# Altium schematic sheet 09_Zynq DDR.SchDoc
size A3; SheetNumber: 9; SheetTotal: 14
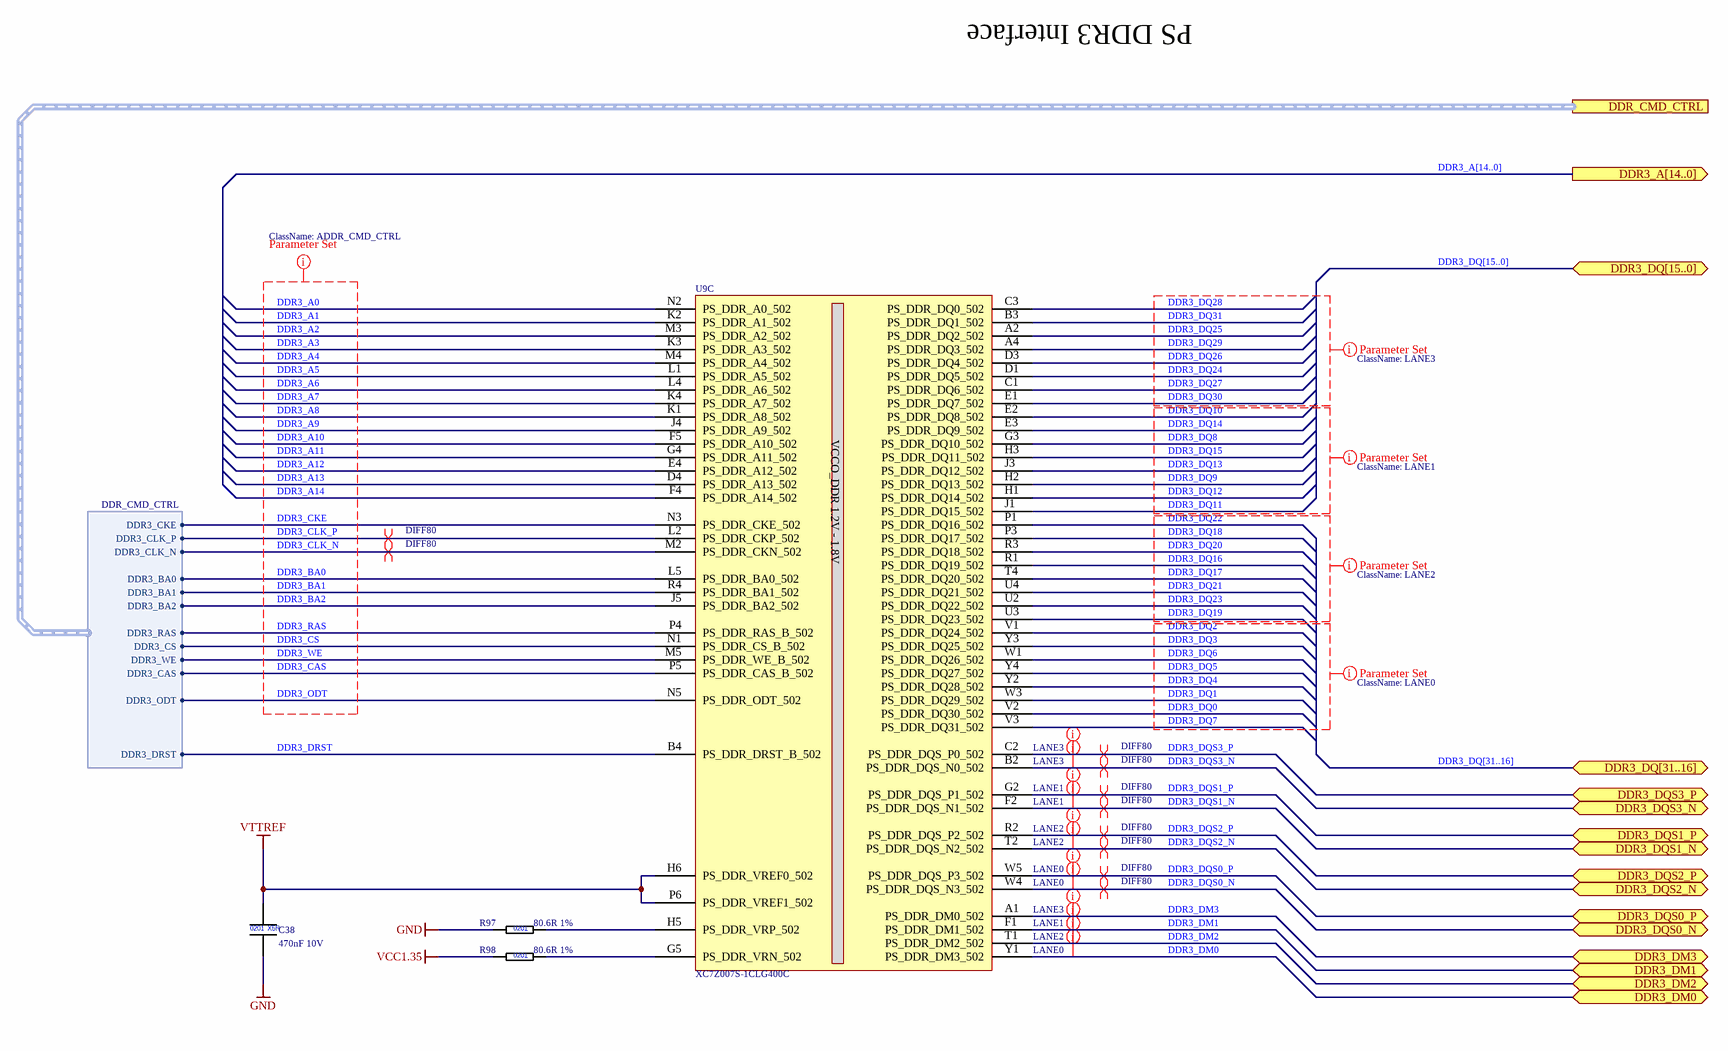
[diagram p0: 09_Zynq DDR.SchDoc]

## Parts
C38  470nF 10V  [CAPC0603X03L]
R97  80.6R 1%  [RESC0603X03L]
R98  80.6R 1%  [RESC0603X03L]
U9  XC7Z007S-1CLG400C  [BGA400C80P20X20_1700X1700X160]  (part C of 8)

## Ports
DDR3_A[14..0] (out), DDR3_DM0 (bidir), DDR3_DM1 (bidir), DDR3_DM2 (bidir), DDR3_DM3 (bidir), DDR3_DQ[15..0] (bidir), DDR3_DQ[31..16] (bidir), DDR3_DQS0_N (bidir), DDR3_DQS0_P (bidir), DDR3_DQS1_N (bidir), DDR3_DQS1_P (bidir), DDR3_DQS2_N (bidir), DDR3_DQS2_P (bidir), DDR3_DQS3_N (bidir), DDR3_DQS3_P (bidir), DDR_CMD_CTRL (harness DDR_CMD_CTRL)

## Harnesses
DDR_CMD_CTRL: DDR3_CLK_P, DDR3_CLK_N, DDR3_CKE, DDR3_BA0, DDR3_BA1, DDR3_RAS, DDR3_CS, DDR3_WE, DDR3_CAS, DDR3_BA2, DDR3_ODT, DDR3_DRST

## Nets
GND: C38.2 R97.1
VCC1.35: R98.1
VTTREF: C38.1 U9.H6(PS_DDR_VREF0_502) U9.P6(PS_DDR_VREF1_502)
DDR3_A0: U9.N2(PS_DDR_A0_502)
DDR3_A1: U9.K2(PS_DDR_A1_502)
DDR3_A2: U9.M3(PS_DDR_A2_502)
DDR3_A3: U9.K3(PS_DDR_A3_502)
DDR3_A4: U9.M4(PS_DDR_A4_502)
DDR3_A5: U9.L1(PS_DDR_A5_502)
DDR3_A6: U9.L4(PS_DDR_A6_502)
DDR3_A7: U9.K4(PS_DDR_A7_502)
DDR3_A8: U9.K1(PS_DDR_A8_502)
DDR3_A9: U9.J4(PS_DDR_A9_502)
DDR3_A10: U9.F5(PS_DDR_A10_502)
DDR3_A11: U9.G4(PS_DDR_A11_502)
DDR3_A12: U9.E4(PS_DDR_A12_502)
DDR3_A13: U9.D4(PS_DDR_A13_502)
DDR3_A14: U9.F4(PS_DDR_A14_502)
DDR3_BA0: U9.L5(PS_DDR_BA0_502) ; port DDR_CMD_CTRL.DDR3_BA0
DDR3_BA1: U9.R4(PS_DDR_BA1_502) ; port DDR_CMD_CTRL.DDR3_BA1
DDR3_BA2: U9.J5(PS_DDR_BA2_502) ; port DDR_CMD_CTRL.DDR3_BA2
DDR3_CAS: U9.P5(PS_DDR_CAS_B_502) ; port DDR_CMD_CTRL.DDR3_CAS
DDR3_CKE: U9.N3(PS_DDR_CKE_502) ; port DDR_CMD_CTRL.DDR3_CKE
DDR3_CLK_N: U9.M2(PS_DDR_CKN_502) ; port DDR_CMD_CTRL.DDR3_CLK_N
DDR3_CLK_P: U9.L2(PS_DDR_CKP_502) ; port DDR_CMD_CTRL.DDR3_CLK_P
DDR3_CS: U9.N1(PS_DDR_CS_B_502) ; port DDR_CMD_CTRL.DDR3_CS
DDR3_DM0: U9.Y1(PS_DDR_DM3_502) ; port DDR3_DM0
DDR3_DM1: U9.F1(PS_DDR_DM1_502) ; port DDR3_DM1
DDR3_DM2: U9.T1(PS_DDR_DM2_502) ; port DDR3_DM2
DDR3_DM3: U9.A1(PS_DDR_DM0_502) ; port DDR3_DM3
DDR3_DQ0: U9.V2(PS_DDR_DQ30_502)
DDR3_DQ1: U9.W3(PS_DDR_DQ29_502)
DDR3_DQ2: U9.V1(PS_DDR_DQ24_502)
DDR3_DQ3: U9.Y3(PS_DDR_DQ25_502)
DDR3_DQ4: U9.Y2(PS_DDR_DQ28_502)
DDR3_DQ5: U9.Y4(PS_DDR_DQ27_502)
DDR3_DQ6: U9.W1(PS_DDR_DQ26_502)
DDR3_DQ7: U9.V3(PS_DDR_DQ31_502)
DDR3_DQ8: U9.G3(PS_DDR_DQ10_502)
DDR3_DQ9: U9.H2(PS_DDR_DQ13_502)
DDR3_DQ10: U9.E2(PS_DDR_DQ8_502)
DDR3_DQ11: U9.J1(PS_DDR_DQ15_502)
DDR3_DQ12: U9.H1(PS_DDR_DQ14_502)
DDR3_DQ13: U9.J3(PS_DDR_DQ12_502)
DDR3_DQ14: U9.E3(PS_DDR_DQ9_502)
DDR3_DQ15: U9.H3(PS_DDR_DQ11_502)
DDR3_DQ16: U9.R1(PS_DDR_DQ19_502)
DDR3_DQ17: U9.T4(PS_DDR_DQ20_502)
DDR3_DQ18: U9.P3(PS_DDR_DQ17_502)
DDR3_DQ19: U9.U3(PS_DDR_DQ23_502)
DDR3_DQ20: U9.R3(PS_DDR_DQ18_502)
DDR3_DQ21: U9.U4(PS_DDR_DQ21_502)
DDR3_DQ22: U9.P1(PS_DDR_DQ16_502)
DDR3_DQ23: U9.U2(PS_DDR_DQ22_502)
DDR3_DQ24: U9.D1(PS_DDR_DQ5_502)
DDR3_DQ25: U9.A2(PS_DDR_DQ2_502)
DDR3_DQ26: U9.D3(PS_DDR_DQ4_502)
DDR3_DQ27: U9.C1(PS_DDR_DQ6_502)
DDR3_DQ28: U9.C3(PS_DDR_DQ0_502)
DDR3_DQ29: U9.A4(PS_DDR_DQ3_502)
DDR3_DQ30: U9.E1(PS_DDR_DQ7_502)
DDR3_DQ31: U9.B3(PS_DDR_DQ1_502)
DDR3_DQS0_N: U9.W4(PS_DDR_DQS_N3_502) ; port DDR3_DQS0_N
DDR3_DQS0_P: U9.W5(PS_DDR_DQS_P3_502) ; port DDR3_DQS0_P
DDR3_DQS1_N: U9.F2(PS_DDR_DQS_N1_502) ; port DDR3_DQS1_N
DDR3_DQS1_P: U9.G2(PS_DDR_DQS_P1_502) ; port DDR3_DQS1_P
DDR3_DQS2_N: U9.T2(PS_DDR_DQS_N2_502) ; port DDR3_DQS2_N
DDR3_DQS2_P: U9.R2(PS_DDR_DQS_P2_502) ; port DDR3_DQS2_P
DDR3_DQS3_N: U9.B2(PS_DDR_DQS_N0_502) ; port DDR3_DQS3_N
DDR3_DQS3_P: U9.C2(PS_DDR_DQS_P0_502) ; port DDR3_DQS3_P
DDR3_DRST: U9.B4(PS_DDR_DRST_B_502) ; port DDR_CMD_CTRL.DDR3_DRST
DDR3_ODT: U9.N5(PS_DDR_ODT_502) ; port DDR_CMD_CTRL.DDR3_ODT
DDR3_RAS: U9.P4(PS_DDR_RAS_B_502) ; port DDR_CMD_CTRL.DDR3_RAS
DDR3_WE: U9.M5(PS_DDR_WE_B_502) ; port DDR_CMD_CTRL.DDR3_WE
NetR97_2: R97.2 U9.H5(PS_DDR_VRP_502)
NetR98_2: R98.2 U9.G5(PS_DDR_VRN_502)

## Buses and harness runs
bus DDR3_A[14..0] = port DDR3_A[14..0]
bus DDR3_DQ[15..0] = port DDR3_DQ[15..0]
bus DDR3_DQ[31..16] = port DDR3_DQ[31..16]

## Layout directives
differential pair; net class DIFF80: DDR3_CLK_N, DDR3_CLK_P, DDR3_DQS0_N, DDR3_DQS0_P, DDR3_DQS1_N, DDR3_DQS1_P, DDR3_DQS2_N, DDR3_DQS2_P, DDR3_DQS3_N, DDR3_DQS3_P
net class LANE0: DDR3_DM0, DDR3_DQ0, DDR3_DQ1, DDR3_DQ2, DDR3_DQ3, DDR3_DQ4, DDR3_DQ5, DDR3_DQ6, DDR3_DQ7, DDR3_DQS0_N, DDR3_DQS0_P
net class LANE1: DDR3_DM1, DDR3_DQ8, DDR3_DQ9, DDR3_DQ10, DDR3_DQ11, DDR3_DQ12, DDR3_DQ13, DDR3_DQ14, DDR3_DQ15, DDR3_DQS1_N, DDR3_DQS1_P
net class LANE2: DDR3_DM2, DDR3_DQ16, DDR3_DQ17, DDR3_DQ18, DDR3_DQ19, DDR3_DQ20, DDR3_DQ21, DDR3_DQ22, DDR3_DQ23, DDR3_DQS2_N, DDR3_DQS2_P
net class LANE3: DDR3_DM3, DDR3_DQ24, DDR3_DQ25, DDR3_DQ26, DDR3_DQ27, DDR3_DQ28, DDR3_DQ29, DDR3_DQ30, DDR3_DQ31, DDR3_DQS3_N, DDR3_DQS3_P
net class ADDR_CMD_CTRL: DDR3_A0, DDR3_A1, DDR3_A2, DDR3_A3, DDR3_A4, DDR3_A5, DDR3_A6, DDR3_A7, DDR3_A8, DDR3_A9, DDR3_A10, DDR3_A11, DDR3_A12, DDR3_A13, DDR3_A14, DDR3_BA0, DDR3_BA1, DDR3_BA2, DDR3_CAS, DDR3_CKE, DDR3_CLK_N, DDR3_CLK_P, DDR3_CS, DDR3_ODT, DDR3_RAS, DDR3_WE

## Notes on the sheet
- PS DDR3 Interface
- Title:
- ++CONFIDENTIAL++
- Datum:
- Blatt:
- von:
- Zeit:
- Entwickler:
- Der transparenteste Entwicklungsdienstleister
  der Elektronik- und Softwareentwicklung
- The  information  contained  in  these  documents  is  confidential,  privileged  and  only  for  the
  information of the intended recipient and may
  not be used, published or redistributed without
  the prior written consent from PCB Arts GmbH.
- Revision:
- Checked:
- https://pcb-arts.com/
- mail@pcb-arts.com
- (in symbol CAP_0201_470nF_10V) 0201; X5R
- (in symbol RES_0201_80.6R_1%) 0201
- (in symbol XC7Z007S-1CLG400C_Processors - Application Specialised, part C) VCCO_DDR 1.2V - 1.8V

## Library data of the parts
C38 = CAP_0201_470nF_10V: Multilayer Ceramic Capacitors MLCC - SMD/SMT 0201 10VDC; Manufacturer 1: Taiyo Yuden; Manufacturer 1 Prt. Nr.: LMK063BBJ474KPLF; Manufacturer 2 Prt. Nr.: C0603X5R1A474M030BC; Manufacturer 2: TDK
R97 R98 = RES_0201_80.6R_1%: Thick Film Resistors - SMD 80.6R OHM 1%; Manufacturer 1: Yageo; Manufacturer 1 Prt. Nr.: RC0201FR-0780R6L; Manufacturer 2 Prt. Nr.: CRCW020180R6FKED; Manufacturer 2: Vishay / Dale
U9 = XC7Z007S-1CLG400C_Processors - Application Specialised: Manufacturer 1: Xilinx; Manufacturer 1 Prt. Nr.: XC7Z007S-1CLG400C